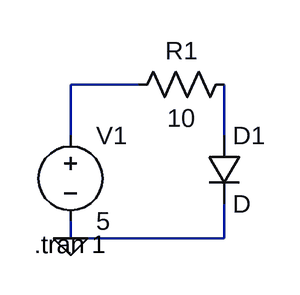
[diagram p0: schematic Draft1.asc]
Draft1.asc, the LTspice schematic file:
Version 4
SHEET 1 880 680
WIRE 144 240 80 240
WIRE 80 288 80 240
WIRE 224 288 224 240
WIRE 80 384 80 368
WIRE 224 384 224 352
WIRE 224 384 80 384
FLAG 80 384 0
SYMBOL voltage 80 272 R0
WINDOW 123 0 0 Left 0
WINDOW 39 0 0 Left 0
SYMATTR InstName V1
SYMATTR Value 5
SYMBOL res 240 224 R90
WINDOW 0 0 56 VBottom 2
WINDOW 3 32 56 VTop 2
SYMATTR InstName R1
SYMATTR Value 10
SYMBOL diode 208 288 R0
SYMATTR InstName D1
TEXT 46 390 Left 2 !.tran 1

The netlist it stands for:
* Draft1.asc
V1 N001 0 5
R1 N002 N001 10
D1 N002 0 D
.model D D
.lib standard.dio
.tran 1
.backanno
.end